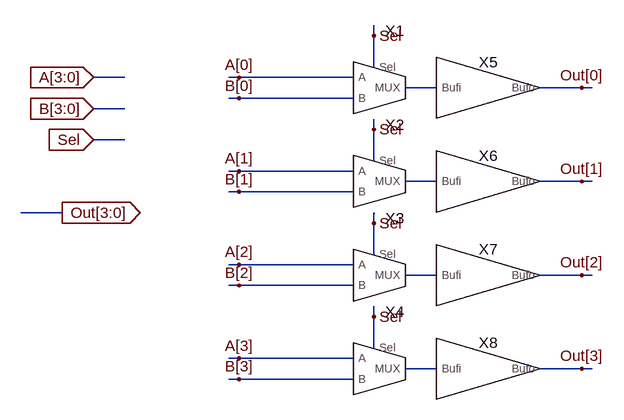
[diagram p0: schematic MUX4.asc]
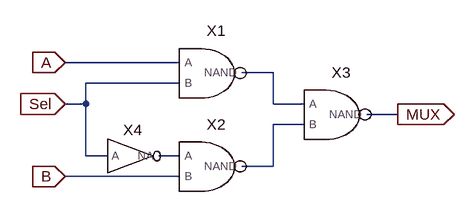
[diagram p1: sub-circuit mux.asc]
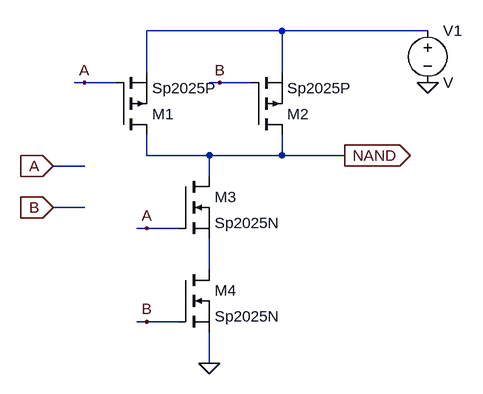
[diagram p2: sub-circuit nand.asc]
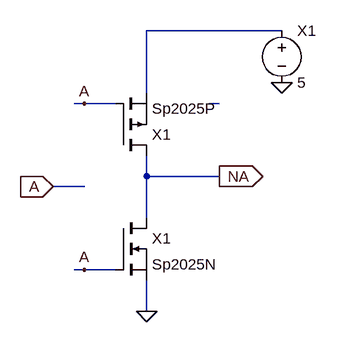
[diagram p3: sub-circuit invert.asc]
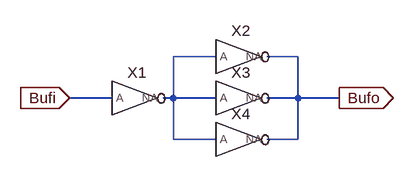
[diagram p4: sub-circuit buffer.asc]
MUX4.asc, the LTspice schematic file:
Version 4
SHEET 1 880 680
WIRE 176 48 176 32
WIRE 176 96 176 48
WIRE -208 112 -256 112
WIRE -32 112 -48 112
WIRE 144 112 -32 112
WIRE 272 128 224 128
WIRE 496 128 432 128
WIRE 512 128 496 128
WIRE -32 144 -48 144
WIRE 144 144 -32 144
WIRE -208 160 -256 160
WIRE 176 192 176 176
WIRE -208 208 -256 208
WIRE 176 240 176 192
WIRE -32 256 -48 256
WIRE 144 256 -32 256
WIRE 272 272 224 272
WIRE 496 272 432 272
WIRE 512 272 496 272
WIRE -32 288 -48 288
WIRE 144 288 -32 288
WIRE -304 320 -368 320
WIRE 176 336 176 320
WIRE 176 384 176 336
WIRE -32 400 -48 400
WIRE 144 400 -32 400
WIRE 272 416 224 416
WIRE 496 416 432 416
WIRE 512 416 496 416
WIRE -32 432 -48 432
WIRE 144 432 -32 432
WIRE 176 480 176 464
WIRE 176 528 176 480
WIRE -32 544 -48 544
WIRE 144 544 -32 544
WIRE 272 560 224 560
WIRE 496 560 432 560
WIRE 512 560 496 560
WIRE -32 576 -48 576
WIRE 144 576 -32 576
FLAG 176 48 Sel
FLAG -256 112 A[3:0]
IOPIN -256 112 In
FLAG -256 160 B[3:0]
IOPIN -256 160 In
FLAG -256 208 Sel
IOPIN -256 208 In
FLAG -32 112 A[0]
FLAG -32 144 B[0]
FLAG 496 128 Out[0]
FLAG -304 320 Out[3:0]
IOPIN -304 320 Out
FLAG 176 192 Sel
FLAG -32 256 A[1]
FLAG -32 288 B[1]
FLAG 496 272 Out[1]
FLAG 176 336 Sel
FLAG -32 400 A[2]
FLAG -32 432 B[2]
FLAG 496 416 Out[2]
FLAG 176 480 Sel
FLAG -32 544 A[3]
FLAG -32 576 B[3]
FLAG 496 560 Out[3]
SYMBOL MUX 208 112 R0
SYMATTR InstName X1
SYMBOL MUX 208 256 R0
SYMATTR InstName X2
SYMBOL MUX 208 400 R0
SYMATTR InstName X3
SYMBOL MUX 208 544 R0
SYMATTR InstName X4
SYMBOL Buffer 352 128 R0
SYMATTR InstName X5
SYMBOL Buffer 352 272 R0
SYMATTR InstName X6
SYMBOL Buffer 352 416 R0
SYMATTR InstName X7
SYMBOL Buffer 352 560 R0
SYMATTR InstName X8

mux.asc, the sub-circuit schematic file:
Version 4
SHEET 1 880 680
WIRE 96 80 -80 80
WIRE 240 96 192 96
WIRE 96 112 -48 112
WIRE -48 144 -48 112
WIRE -48 144 -80 144
WIRE 240 144 240 96
WIRE 288 144 240 144
WIRE 432 160 384 160
WIRE 288 176 240 176
WIRE -48 224 -48 144
WIRE -16 224 -48 224
WIRE 96 224 64 224
WIRE 240 240 240 176
WIRE 240 240 192 240
WIRE 96 256 -80 256
FLAG 432 160 MUX
IOPIN 432 160 Out
FLAG -80 80 A
IOPIN -80 80 In
FLAG -80 256 B
IOPIN -80 256 In
FLAG -80 144 Sel
IOPIN -80 144 In
SYMBOL NAND 144 96 R0
SYMATTR InstName X1
SYMBOL NAND 144 240 R0
SYMATTR InstName X2
SYMBOL NAND 336 160 R0
SYMATTR InstName X3
SYMBOL INVERT 16 224 R0
SYMATTR InstName X4

nand.asc, the sub-circuit schematic file:
Version 4
SHEET 1 880 680
.lib SHEET 1 880 680
WIRE 336 -160 128 -160
WIRE 560 -160 336 -160
WIRE 128 -96 128 -160
WIRE 336 -96 336 -160
WIRE 32 -80 16 -80
WIRE 80 -80 32 -80
WIRE 240 -80 224 -80
WIRE 288 -80 240 -80
WIRE 128 32 128 0
WIRE 224 32 128 32
WIRE 336 32 336 0
WIRE 336 32 224 32
WIRE 432 32 336 32
WIRE 32 48 -16 48
WIRE 224 64 224 32
WIRE 32 112 -16 112
WIRE 128 144 112 144
WIRE 176 144 128 144
WIRE 224 208 224 160
WIRE 128 288 112 288
WIRE 176 288 128 288
WIRE 224 352 224 304
FLAG 224 352 0
FLAG -16 48 A
IOPIN -16 48 In
FLAG -16 112 B
IOPIN -16 112 In
FLAG 128 144 A
FLAG 128 288 B
FLAG 32 -80 A
FLAG 240 -80 B
FLAG 432 32 NAND
IOPIN 432 32 Out
FLAG 560 -80 0
SYMBOL pmos 80 0 M180
SYMATTR InstName M1
SYMATTR Value Sp2025P
SYMBOL pmos 288 0 M180
SYMATTR InstName M2
SYMATTR Value Sp2025P
SYMBOL nmos 176 64 R0
SYMATTR InstName M3
SYMATTR Value Sp2025N
SYMBOL nmos 176 208 R0
SYMATTR InstName M4
SYMATTR Value Sp2025N
SYMBOL voltage 560 -176 R0
SYMATTR InstName V1

invert.asc, the sub-circuit schematic file:
Version 4
SHEET 1 880 680
WIRE 352 -80 144 -80
WIRE 144 16 144 -80
WIRE 48 32 32 32
WIRE 96 32 48 32
WIRE 256 32 240 32
WIRE 144 144 144 112
WIRE 256 144 144 144
WIRE 48 160 0 160
WIRE 144 208 144 144
WIRE 48 288 32 288
WIRE 96 288 48 288
WIRE 144 352 144 304
FLAG 144 352 0
FLAG 0 160 A
IOPIN 0 160 In
FLAG 48 288 A
FLAG 48 32 A
FLAG 256 144 NA
IOPIN 256 144 Out
FLAG 352 0 0
SYMBOL pmos 96 112 M180
SYMATTR InstName X1
SYMATTR Value Sp2025P
SYMBOL nmos 96 208 R0
SYMATTR InstName X1
SYMATTR Value Sp2025N
SYMBOL voltage 352 -96 R0
SYMATTR InstName X1
SYMATTR Value 5

buffer.asc, the sub-circuit schematic file:
Version 4
SHEET 1 880 680
WIRE 224 64 160 64
WIRE 352 64 304 64
WIRE 64 128 0 128
WIRE 160 128 160 64
WIRE 160 128 144 128
WIRE 224 128 160 128
WIRE 352 128 352 64
WIRE 352 128 304 128
WIRE 416 128 352 128
WIRE 160 192 160 128
WIRE 224 192 160 192
WIRE 352 192 352 128
WIRE 352 192 304 192
FLAG 0 128 Bufi
IOPIN 0 128 In
FLAG 416 128 Bufo
IOPIN 416 128 Out
SYMBOL INVERT 96 128 R0
SYMATTR InstName X1
SYMBOL INVERT 256 64 R0
SYMATTR InstName X2
SYMBOL INVERT 256 128 R0
SYMATTR InstName X3
SYMBOL INVERT 256 192 R0
SYMATTR InstName X4

The netlist it stands for:
* MUX4.asc
XX1 A[0] B[0] Sel N001 mux
XX2 A[1] B[1] Sel N002 mux
XX3 A[2] B[2] Sel N003 mux
XX4 A[3] B[3] Sel N004 mux
XX5 N001 Out[0] buffer
XX6 N002 Out[1] buffer
XX7 N003 Out[2] buffer
XX8 N004 Out[3] buffer

* block symbol definitions
.subckt mux A B Sel MUX
XX1 A Sel N001 nand
XX2 N003 B N002 nand
XX3 N001 N002 MUX nand
XX4 Sel N003 invert
.ends mux

.subckt nand A B NAND
M1 NAND A N001 N001 Sp2025P
M2 NAND B N001 N001 Sp2025P
M3 NAND A N002 N002 Sp2025N
M4 N002 B 0 0 Sp2025N
V1 N001 0 V
.ends nand

.subckt invert A NA
M§X1 NA A N001 N001 Sp2025P
M§X1 NA A 0 0 Sp2025N
V§X1 N001 0 5
.ends invert

.subckt buffer Bufi Bufo
XX1 Bufi N001 invert
XX2 N001 Bufo invert
XX3 N001 Bufo invert
XX4 N001 Bufo invert
.ends buffer

.model NMOS NMOS
.model PMOS PMOS
.lib standard.mos
.backanno
.end